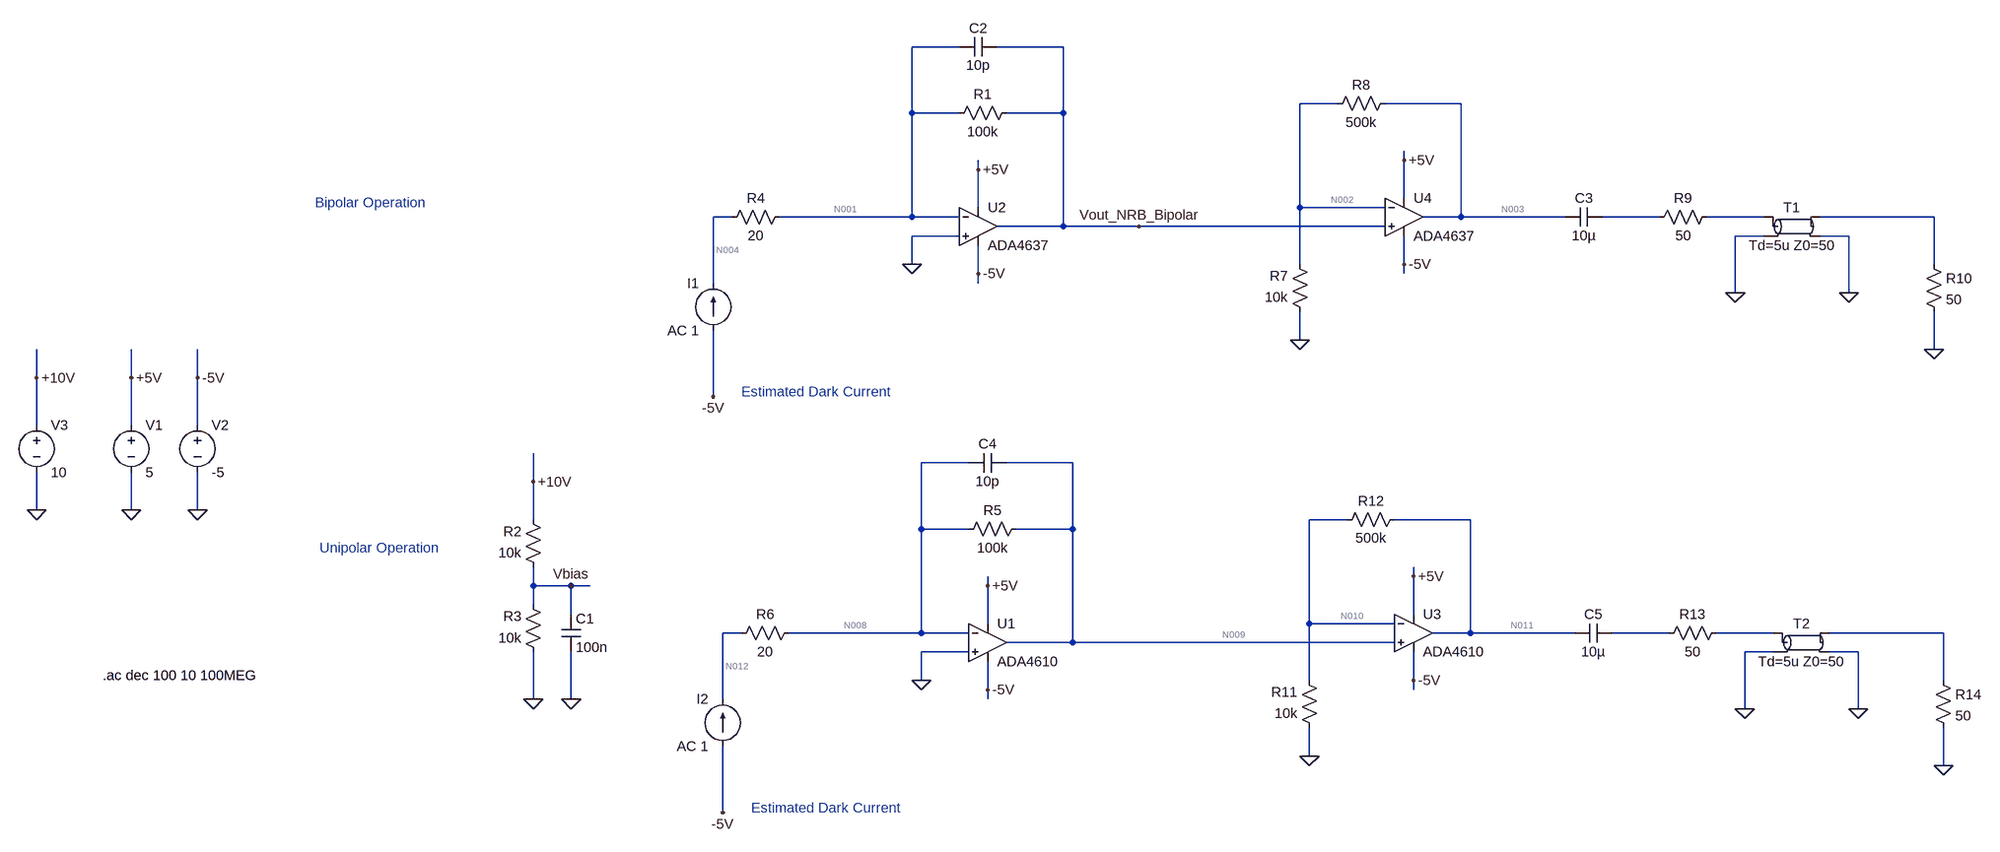
[diagram p0: schematic TIA_Preamp_Linedriver_ADA4637-1.asc]
TIA_Preamp_Linedriver_ADA4637-1.asc, the LTspice schematic file:
Version 4
SHEET 1 3412 836
WIRE 1232 -544 1152 -544
WIRE 1408 -544 1296 -544
WIRE 1872 -448 1808 -448
WIRE 2080 -448 1952 -448
WIRE 1152 -432 1152 -544
WIRE 1232 -432 1152 -432
WIRE 1408 -432 1408 -544
WIRE 1408 -432 1312 -432
WIRE 1984 -352 1984 -368
WIRE 1264 -336 1264 -352
WIRE 1984 -288 1984 -352
WIRE 1264 -272 1264 -336
WIRE 1808 -272 1808 -448
WIRE 1952 -272 1808 -272
WIRE 848 -256 816 -256
WIRE 1152 -256 1152 -432
WIRE 1152 -256 928 -256
WIRE 1232 -256 1152 -256
WIRE 2080 -256 2080 -448
WIRE 2080 -256 2016 -256
WIRE 2256 -256 2080 -256
WIRE 2416 -256 2320 -256
WIRE 2592 -256 2496 -256
WIRE 2880 -256 2688 -256
WIRE 1408 -240 1408 -432
WIRE 1408 -240 1296 -240
WIRE 1536 -240 1408 -240
WIRE 1952 -240 1536 -240
WIRE 1232 -224 1152 -224
WIRE 2592 -224 2544 -224
WIRE 2736 -224 2688 -224
WIRE 1152 -176 1152 -224
WIRE 1808 -176 1808 -272
WIRE 1984 -176 1984 -224
WIRE 2880 -176 2880 -256
WIRE 1264 -160 1264 -208
WIRE 1984 -160 1984 -176
WIRE 816 -144 816 -256
WIRE 1264 -144 1264 -160
WIRE 2544 -128 2544 -224
WIRE 2736 -128 2736 -224
WIRE 1808 -48 1808 -96
WIRE 2880 -32 2880 -96
WIRE -1008 16 -1008 -32
WIRE -848 16 -848 -32
WIRE -736 16 -736 -32
WIRE 816 48 816 -64
WIRE -1008 96 -1008 16
WIRE -848 96 -848 16
WIRE -736 96 -736 16
WIRE 1248 160 1168 160
WIRE 1424 160 1312 160
WIRE 480 192 480 144
WIRE -1008 240 -1008 176
WIRE -848 240 -848 176
WIRE -736 240 -736 176
WIRE 480 256 480 192
WIRE 1888 256 1824 256
WIRE 2096 256 1968 256
WIRE 1168 272 1168 160
WIRE 1248 272 1168 272
WIRE 1424 272 1424 160
WIRE 1424 272 1328 272
WIRE 2000 352 2000 336
WIRE 480 368 480 336
WIRE 544 368 480 368
WIRE 576 368 544 368
WIRE 1280 368 1280 352
WIRE 480 400 480 368
WIRE 544 416 544 368
WIRE 2000 416 2000 352
WIRE 1280 432 1280 368
WIRE 1824 432 1824 256
WIRE 1968 432 1824 432
WIRE 864 448 832 448
WIRE 1168 448 1168 272
WIRE 1168 448 944 448
WIRE 1248 448 1168 448
WIRE 2096 448 2096 256
WIRE 2096 448 2032 448
WIRE 2272 448 2096 448
WIRE 2432 448 2336 448
WIRE 2608 448 2512 448
WIRE 2896 448 2704 448
WIRE 1424 464 1424 272
WIRE 1424 464 1312 464
WIRE 1968 464 1424 464
WIRE 1248 480 1168 480
WIRE 2608 480 2560 480
WIRE 2752 480 2704 480
WIRE 1168 528 1168 480
WIRE 1824 528 1824 432
WIRE 2000 528 2000 480
WIRE 2896 528 2896 448
WIRE 1280 544 1280 496
WIRE 2000 544 2000 528
WIRE 480 560 480 480
WIRE 544 560 544 480
WIRE 832 560 832 448
WIRE 1280 560 1280 544
WIRE 2560 576 2560 480
WIRE 2752 576 2752 480
WIRE 1824 656 1824 608
WIRE 2896 672 2896 608
WIRE 832 752 832 640
FLAG -848 240 0
FLAG -848 16 +5V
FLAG -736 240 0
FLAG -736 16 -5V
FLAG 1264 -160 -5V
FLAG 1264 -336 +5V
FLAG 480 192 +10V
FLAG 544 368 Vbias
FLAG 544 560 0
FLAG 816 48 -5V
FLAG 1152 -176 0
FLAG 1536 -240 Vout_NRB_Bipolar
FLAG -1008 240 0
FLAG -1008 16 +10V
FLAG 480 560 0
FLAG 1984 -176 -5V
FLAG 1984 -352 +5V
FLAG 1808 -48 0
FLAG 2880 -32 0
FLAG 2544 -128 0
FLAG 2736 -128 0
FLAG 1280 544 -5V
FLAG 1280 368 +5V
FLAG 832 752 -5V
FLAG 1168 528 0
FLAG 2000 528 -5V
FLAG 2000 352 +5V
FLAG 1824 656 0
FLAG 2896 672 0
FLAG 2560 576 0
FLAG 2752 576 0
SYMBOL voltage -848 80 R0
WINDOW 123 0 0 Left 0
WINDOW 39 0 0 Left 0
SYMATTR InstName V1
SYMATTR Value 5
SYMBOL voltage -736 80 R0
WINDOW 123 0 0 Left 0
WINDOW 39 0 0 Left 0
SYMATTR InstName V2
SYMATTR Value -5
SYMBOL res 1328 -448 R90
WINDOW 0 0 56 VBottom 2
WINDOW 3 32 56 VTop 2
SYMATTR InstName R1
SYMATTR Value 100k
SYMBOL res 496 352 R180
WINDOW 0 36 76 Left 2
WINDOW 3 36 40 Left 2
SYMATTR InstName R2
SYMATTR Value 10k
SYMBOL res 496 496 R180
WINDOW 0 36 76 Left 2
WINDOW 3 36 40 Left 2
SYMATTR InstName R3
SYMATTR Value 10k
SYMBOL cap 528 416 R0
SYMATTR InstName C1
SYMATTR Value 100n
SYMBOL cap 1232 -528 R270
WINDOW 0 32 32 VTop 2
WINDOW 3 0 32 VBottom 2
SYMATTR InstName C2
SYMATTR Value 10p
SYMBOL current 816 -64 R180
WINDOW 0 24 80 Left 2
WINDOW 3 24 0 Left 2
WINDOW 123 0 0 Left 0
WINDOW 39 0 0 Left 0
SYMATTR InstName I1
SYMATTR Value AC 1
SYMBOL res 944 -272 R90
WINDOW 0 0 56 VBottom 2
WINDOW 3 32 56 VTop 2
SYMATTR InstName R4
SYMATTR Value 20
SYMBOL voltage -1008 80 R0
WINDOW 123 0 0 Left 0
WINDOW 39 0 0 Left 0
SYMATTR InstName V3
SYMATTR Value 10
SYMBOL res 1824 -80 R180
WINDOW 0 36 76 Left 2
WINDOW 3 36 40 Left 2
SYMATTR InstName R7
SYMATTR Value 10k
SYMBOL res 1856 -432 R270
WINDOW 0 32 56 VTop 2
WINDOW 3 0 56 VBottom 2
SYMATTR InstName R8
SYMATTR Value 500k
SYMBOL res 2512 -272 R90
WINDOW 0 0 56 VBottom 2
WINDOW 3 32 56 VTop 2
SYMATTR InstName R9
SYMATTR Value 50
SYMBOL res 2864 -192 R0
SYMATTR InstName R10
SYMATTR Value 50
SYMBOL tline 2640 -240 R0
SYMATTR InstName T1
SYMATTR Value Td=5u Z0=50
SYMBOL cap 2256 -240 R270
WINDOW 0 32 32 VTop 2
WINDOW 3 0 32 VBottom 2
SYMATTR InstName C3
SYMATTR Value 10µ
SYMBOL OpAmps\\ADA4637 1264 -304 R0
SYMATTR InstName U2
SYMBOL OpAmps\\ADA4637 1984 -320 R0
SYMATTR InstName U4
SYMBOL res 1344 256 R90
WINDOW 0 0 56 VBottom 2
WINDOW 3 32 56 VTop 2
SYMATTR InstName R5
SYMATTR Value 100k
SYMBOL cap 1248 176 R270
WINDOW 0 32 32 VTop 2
WINDOW 3 0 32 VBottom 2
SYMATTR InstName C4
SYMATTR Value 10p
SYMBOL current 832 640 R180
WINDOW 0 24 80 Left 2
WINDOW 3 24 0 Left 2
WINDOW 123 0 0 Left 0
WINDOW 39 0 0 Left 0
SYMATTR InstName I2
SYMATTR Value AC 1
SYMBOL res 960 432 R90
WINDOW 0 0 56 VBottom 2
WINDOW 3 32 56 VTop 2
SYMATTR InstName R6
SYMATTR Value 20
SYMBOL res 1840 624 R180
WINDOW 0 36 76 Left 2
WINDOW 3 36 40 Left 2
SYMATTR InstName R11
SYMATTR Value 10k
SYMBOL res 1872 272 R270
WINDOW 0 32 56 VTop 2
WINDOW 3 0 56 VBottom 2
SYMATTR InstName R12
SYMATTR Value 500k
SYMBOL res 2528 432 R90
WINDOW 0 0 56 VBottom 2
WINDOW 3 32 56 VTop 2
SYMATTR InstName R13
SYMATTR Value 50
SYMBOL res 2880 512 R0
SYMATTR InstName R14
SYMATTR Value 50
SYMBOL tline 2656 464 R0
SYMATTR InstName T2
SYMATTR Value Td=5u Z0=50
SYMBOL cap 2272 464 R270
WINDOW 0 32 32 VTop 2
WINDOW 3 0 32 VBottom 2
SYMATTR InstName C5
SYMATTR Value 10µ
SYMBOL OpAmps\\ADA4610 1280 400 R0
SYMATTR InstName U1
SYMBOL OpAmps\\ADA4610 2000 384 R0
SYMATTR InstName U3
TEXT -896 520 Left 2 !.ac dec 100 10 100MEG
TEXT -144 -280 Left 2 ;Bipolar Operation
TEXT -136 304 Left 2 ;Unipolar Operation
TEXT 864 40 Left 2 ;Estimated Dark Current
TEXT 880 744 Left 2 ;Estimated Dark Current

The netlist it stands for:
* TIA_Preamp_Linedriver_ADA4637-1.asc
V1 +5V 0 5
V2 -5V 0 -5
R1 Vout_NRB_Bipolar N001 100k
R2 Vbias +10V 10k
R3 0 Vbias 10k
C1 Vbias 0 100n
C2 N001 Vout_NRB_Bipolar 10p
I1 -5V N004 AC 1
R4 N001 N004 20
V3 +10V 0 10
R7 0 N002 10k
R8 N002 N003 500k
R9 N006 N005 50
R10 N007 0 50
T1 N006 0 N007 0 Td=5u Z0=50
C3 N003 N005 10µ
XU2 0 N001 +5V -5V Vout_NRB_Bipolar ADA4637  ; pins In+ In- V+ V- OUT
XU4 Vout_NRB_Bipolar N002 +5V -5V N003 ADA4637  ; pins In+ In- V+ V- OUT
R5 N009 N008 100k
C4 N008 N009 10p
I2 -5V N012 AC 1
R6 N008 N012 20
R11 0 N010 10k
R12 N010 N011 500k
R13 N014 N013 50
R14 N015 0 50
T2 N014 0 N015 0 Td=5u Z0=50
C5 N011 N013 10µ
XU1 0 N008 +5V -5V N009 ADA4610  ; pins In+ In- V+ V- OUT
XU3 N009 N010 +5V -5V N011 ADA4610  ; pins In+ In- V+ V- OUT
.ac dec 100 10 100MEG
* Bipolar Operation
* Unipolar Operation
* Estimated Dark Current
* Estimated Dark Current
.backanno
.end

* Results of the author's LTspice run, read from the files saved beside the schematic
* Operating Point, zero values left out:
*   V(+5v) = 5 V
*   V(-5v) = -5 V
*   V(vout_nrb_bipolar) = -31.6 µV
*   V(n001) = -24.21 µV
*   V(vbias) = 5 V
*   V(+10v) = 10 V
*   V(n004) = -24.21 µV
*   V(n002) = -55.8 µV
*   V(n003) = -2.883 mV
*   V(n009) = -503.1 nV
*   V(n008) = -203.1 nV
*   V(n012) = -203.1 nV
*   V(n010) = -705.3 nV
*   V(n011) = -37.47 µV
*   I(R12) = 73.53 pA
*   I(R11) = 70.53 pA
*   I(R5) = -3 pA
*   I(R8) = 5.654 nA
*   I(R7) = 5.58 nA
*   I(R3) = -500 µA
*   I(R2) = -500 µA
*   I(R1) = -73.87 pA
*   I(V3) = -500 µA
*   I(V2) = 21.84 mA
*   I(V1) = -21.84 mA
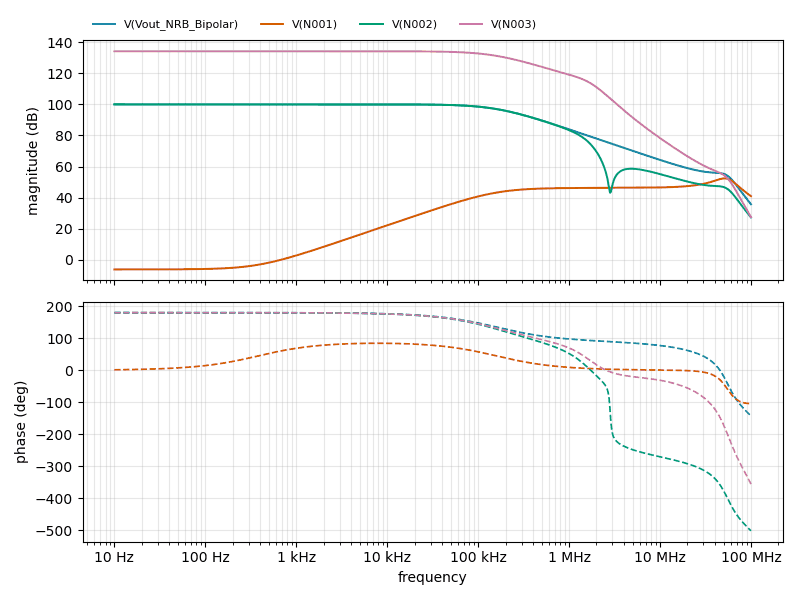
[diagram p1: AC Analysis of TIA_Preamp_Linedriver_ADA4637-1.asc, plotted from the saved traces]
* AC Analysis, 1 run:
*   V(Vout_NRB_Bipolar): 100.00 dB at 10 Hz, 35.79 dB at 100 MHz, peak 100.00 dB at 10 Hz, 3 dB below the peak at 159.4 kHz
*   V(N001): -6.09 dB at 10 Hz, 41.01 dB at 100 MHz, peak 52.45 dB at 51.29 MHz, 3 dB below the peak at 32.88 MHz and 66.21 MHz
*   V(N002): 100.00 dB at 10 Hz, 27.30 dB at 100 MHz, peak 100.00 dB at 10 Hz, 3 dB below the peak at 159.4 kHz
*   V(N003): 134.15 dB at 10 Hz, 27.55 dB at 100 MHz, peak 134.15 dB at 10 Hz, 3 dB below the peak at 160.8 kHz